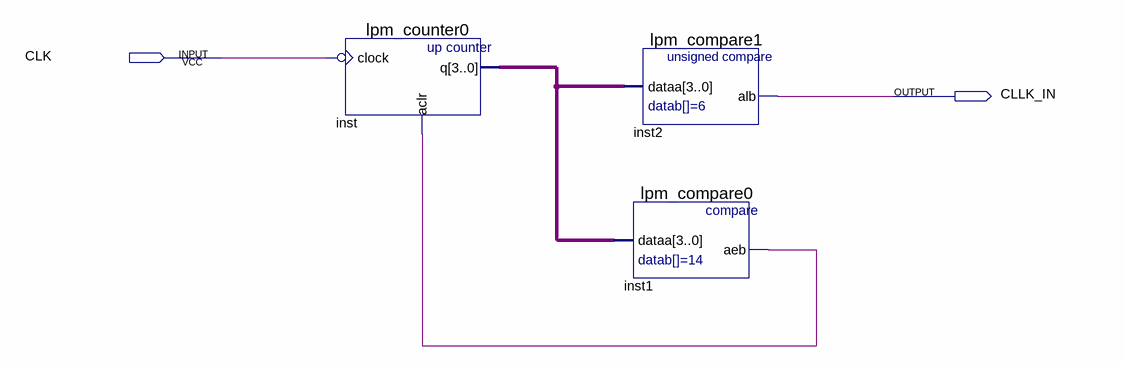
[diagram p0: schematic sheet]
// Quartus schematic kab2.bdf as structural Verilog: 3 symbols, 2 pins
module kab2 (
  input  CLK,
  output CLLK_IN
);

  wire inst1_aeb;
  wire [3:0] inst_q;

  lpm_counter0 inst (.clock(~CLK), .aclr(inst1_aeb), .q(inst_q));
  lpm_compare1 inst2 (.dataa(inst_q), .alb(CLLK_IN));
  lpm_compare0 inst1 (.dataa(inst_q), .aeb(inst1_aeb));
endmodule
